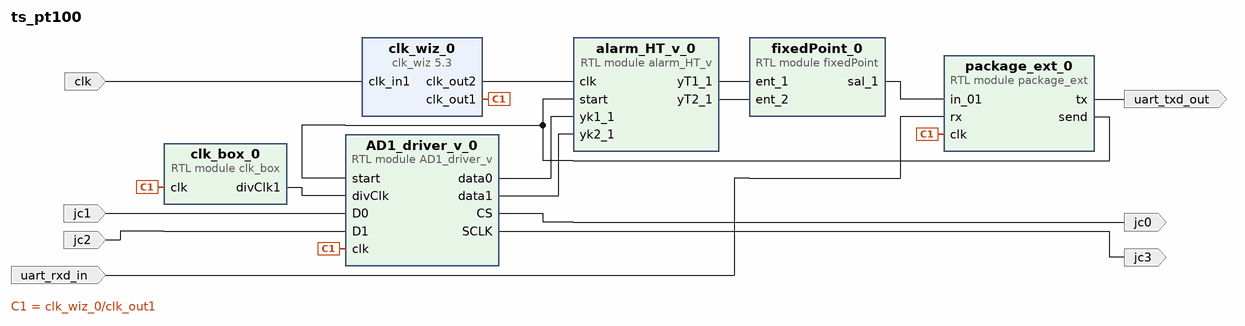
[diagram p0: block diagram of the top level]
# Vivado block design ts_pt100, Vivado 2016.1
create_bd_design ts_pt100

create_bd_port -dir I -type clk clk
set_property -dict {CONFIG.FREQ_HZ 100000000} [get_bd_ports clk]
create_bd_port -dir I uart_rxd_in
create_bd_port -dir O uart_txd_out
create_bd_port -dir I jc1
create_bd_port -dir I jc2
create_bd_port -dir O jc0
create_bd_port -dir O jc3

create_bd_cell -type module -reference alarm_HT_v alarm_HT_v_0
create_bd_cell -type module -reference AD1_driver_v AD1_driver_v_0
create_bd_cell -type module -reference fixedPoint fixedPoint_0
create_bd_cell -type ip -vlnv xilinx.com:ip:clk_wiz:5.3 clk_wiz_0
set_property -dict [list \
  CONFIG.CLKOUT2_USED true \
  CONFIG.NUM_OUT_CLKS 2 \
  CONFIG.CLKOUT1_REQUESTED_OUT_FREQ 60.000 \
  CONFIG.CLKOUT2_REQUESTED_OUT_FREQ 10.000 \
  CONFIG.USE_LOCKED false \
  CONFIG.USE_RESET false \
  CONFIG.MMCM_DIVCLK_DIVIDE 5 \
  CONFIG.MMCM_CLKFBOUT_MULT_F 49.500 \
  CONFIG.MMCM_CLKOUT0_DIVIDE_F 16.500 \
  CONFIG.MMCM_CLKOUT1_DIVIDE 99 \
  CONFIG.CLKOUT1_JITTER 263.048 \
  CONFIG.CLKOUT1_PHASE_ERROR 296.868 \
  CONFIG.CLKOUT2_JITTER 359.525 \
  CONFIG.CLKOUT2_PHASE_ERROR 296.868 \
] [get_bd_cells clk_wiz_0]
create_bd_cell -type module -reference clk_box clk_box_0
create_bd_cell -type module -reference package_ext package_ext_0
set_property -dict {CONFIG.BAUD 3126 CONFIG.SEND_RATE 133280} [get_bd_cells package_ext_0]

# ---- connections ----

connect_bd_net [get_bd_ports clk] [get_bd_pins clk_wiz_0/clk_in1]
connect_bd_net [get_bd_pins clk_wiz_0/clk_out1] [get_bd_pins AD1_driver_v_0/clk] [get_bd_pins clk_box_0/clk] [get_bd_pins package_ext_0/clk]
connect_bd_net [get_bd_pins clk_wiz_0/clk_out2] [get_bd_pins alarm_HT_v_0/clk]
connect_bd_net [get_bd_ports uart_rxd_in] [get_bd_pins package_ext_0/rx]
connect_bd_net [get_bd_pins package_ext_0/tx] [get_bd_ports uart_txd_out]
connect_bd_net [get_bd_pins package_ext_0/send] [get_bd_pins alarm_HT_v_0/start] [get_bd_pins AD1_driver_v_0/start]
connect_bd_net [get_bd_pins AD1_driver_v_0/data0] [get_bd_pins alarm_HT_v_0/yk1_1]
connect_bd_net [get_bd_pins AD1_driver_v_0/data1] [get_bd_pins alarm_HT_v_0/yk2_1]
connect_bd_net [get_bd_pins clk_box_0/divClk1] [get_bd_pins AD1_driver_v_0/divClk]
connect_bd_net -net jc1_1 [get_bd_ports jc1] [get_bd_pins AD1_driver_v_0/D0]
connect_bd_net -net jc2_1 [get_bd_ports jc2] [get_bd_pins AD1_driver_v_0/D1]
connect_bd_net [get_bd_pins AD1_driver_v_0/CS] [get_bd_ports jc0]
connect_bd_net [get_bd_pins AD1_driver_v_0/SCLK] [get_bd_ports jc3]
connect_bd_net [get_bd_pins alarm_HT_v_0/yT1_1] [get_bd_pins fixedPoint_0/ent_1]
connect_bd_net [get_bd_pins alarm_HT_v_0/yT2_1] [get_bd_pins fixedPoint_0/ent_2]
connect_bd_net [get_bd_pins fixedPoint_0/sal_1] [get_bd_pins package_ext_0/in_01]

validate_bd_design
save_bd_design
